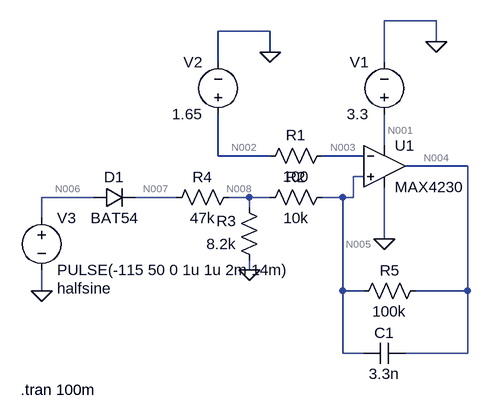
[diagram p0: schematic Draft4.asc]
Draft4.asc, the LTspice schematic file:
Version 4.1
SHEET 1 880 680
WIRE 272 -80 192 -80
WIRE 16 -64 -64 -64
WIRE 272 -48 272 -80
WIRE 16 -32 16 -64
WIRE -64 -16 -64 -64
WIRE 192 -16 192 -80
WIRE 192 112 192 64
WIRE -64 128 -64 64
WIRE 16 128 -64 128
WIRE 160 128 96 128
WIRE 320 144 224 144
WIRE 160 160 144 160
WIRE -256 192 -336 192
WIRE -128 192 -192 192
WIRE -16 192 -48 192
WIRE 16 192 -16 192
WIRE 128 192 96 192
WIRE 144 192 144 160
WIRE 144 192 128 192
WIRE -16 208 -16 192
WIRE -336 224 -336 192
WIRE 192 256 192 176
WIRE -16 304 -16 288
WIRE -336 336 -336 304
WIRE 128 336 128 192
WIRE 160 336 128 336
WIRE 320 336 320 144
WIRE 320 336 240 336
WIRE 128 432 128 336
WIRE 160 432 128 432
WIRE 320 432 320 336
WIRE 320 432 224 432
FLAG 272 -48 0
FLAG 192 256 0
FLAG 16 -32 0
FLAG -16 304 0
FLAG -336 336 0
SYMBOL OpAmps\\MAX4230 192 80 R0
SYMATTR InstName U1
SYMBOL voltage 192 80 R180
WINDOW 0 24 96 Left 2
WINDOW 3 24 16 Left 2
WINDOW 123 0 0 Left 0
WINDOW 39 0 0 Left 0
SYMATTR InstName V1
SYMATTR Value 3.3
SYMBOL res 112 112 R90
WINDOW 0 0 56 VBottom 2
WINDOW 3 32 56 VTop 2
SYMATTR InstName R1
SYMATTR Value 100
SYMBOL voltage -64 80 R180
WINDOW 0 24 96 Left 2
WINDOW 3 24 16 Left 2
WINDOW 123 0 0 Left 0
WINDOW 39 0 0 Left 0
SYMATTR InstName V2
SYMATTR Value 1.65
SYMBOL res 112 176 R90
WINDOW 0 0 56 VBottom 2
WINDOW 3 32 56 VTop 2
SYMATTR InstName R2
SYMATTR Value 10k
SYMBOL res 0 304 R180
WINDOW 0 36 76 Left 2
WINDOW 3 36 40 Left 2
SYMATTR InstName R3
SYMATTR Value 8.2k
SYMBOL res -144 208 R270
WINDOW 0 32 56 VTop 2
WINDOW 3 0 56 VBottom 2
SYMATTR InstName R4
SYMATTR Value 47k
SYMBOL diode -256 208 R270
WINDOW 0 32 32 VTop 2
WINDOW 3 0 32 VBottom 2
SYMATTR InstName D1
SYMATTR Value BAT54
SYMATTR Description Diode
SYMATTR Type diode
SYMBOL voltage -336 208 R0
WINDOW 123 0 0 Left 0
WINDOW 39 24 124 Left 2
SYMATTR InstName V3
SYMATTR Value PULSE(-115 50 0 1u 1u 2m 14m)
SYMATTR SpiceLine halfsine
SYMBOL res 144 352 R270
WINDOW 0 32 56 VTop 2
WINDOW 3 0 56 VBottom 2
SYMATTR InstName R5
SYMATTR Value 100k
SYMBOL cap 224 416 R90
WINDOW 0 0 32 VBottom 2
WINDOW 3 32 32 VTop 2
SYMATTR InstName C1
SYMATTR Value 3.3n
TEXT -368 488 Left 2 !.tran 100m

The netlist it stands for:
* Draft4.asc
X§U1 N005 N003 N001 0 N004 MAX4230  ; pins In+ In- V+ V- OUT
V1 N001 0 3.3
R1 N003 N002 100
V2 N002 0 1.65
R2 N005 N008 10k
R3 0 N008 8.2k
R4 N007 N008 47k
D1 N006 N007 BAT54
V3 N006 0 PULSE(-115 50 0 1u 1u 2m 14m) halfsine
R5 N005 N004 100k
C1 N004 N005 3.3n
.model D D
.lib standard.dio
.tran 100m
.lib MAX4230.lib
.backanno
.end

* Results of the author's LTspice run, read from the files saved beside the schematic
* Operating Point, zero values left out:
*   V(n001) = 3.3 V
*   V(n002) = 1.65 V
*   V(n003) = 1.65 V
*   V(n004) = -6.523 mV
*   V(n005) = -1.699 mV
*   V(n006) = -115 V
*   V(n007) = -5.922 mV
*   V(n008) = -1.217 mV
*   I(D1) = -100.1 nA
*   I(R1) = -1.627 nA
*   I(R2) = -48.26 nA
*   I(R3) = 148.4 nA
*   I(R4) = -100.1 nA
*   I(R5) = 48.24 nA
*   I(V1) = -1.096 mA
*   I(V2) = -1.627 nA
*   I(V3) = 100.1 nA
*   Ix(u1:1) = 22.2 pA
*   Ix(u1:2) = 1.627 nA
*   Ix(u1:3) = 1.096 mA
*   Ix(u1:4) = -1.096 mA
*   Ix(u1:5) = 48.24 nA
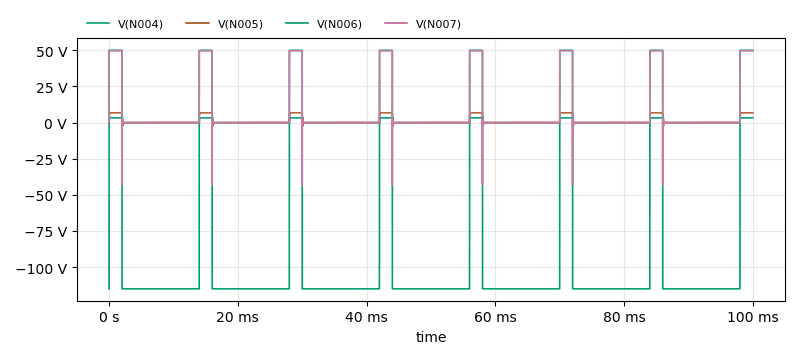
[diagram p1: Transient Analysis of Draft4.asc, plotted from the saved traces]
* Transient Analysis, 1 run:
*   V(N004): min -6.524 mV, max 3.307 V, average 543.2 mV, rms 1.347 V, last 3.306 V
*   V(N005): min -2.155 V, max 6.799 V, average 1.089 V, rms 2.714 V, last 6.799 V
*   V(N006): min -115 V, max 50 V, average -88.59 V, rms 107.3 V, last 50 V
*   V(N007): min -43.32 V, max 49.76 V, average 7.965 V, rms 19.91 V, last 49.76 V